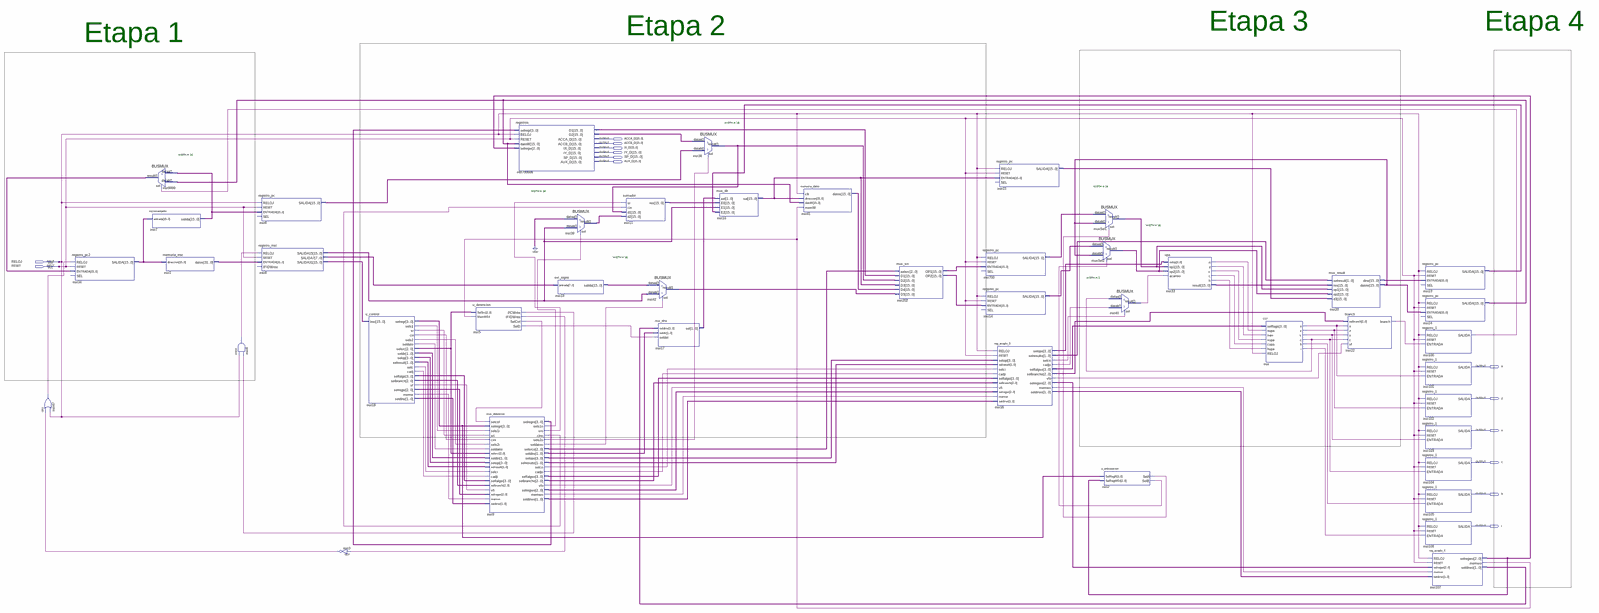
[diagram p0: schematic sheet, whole]
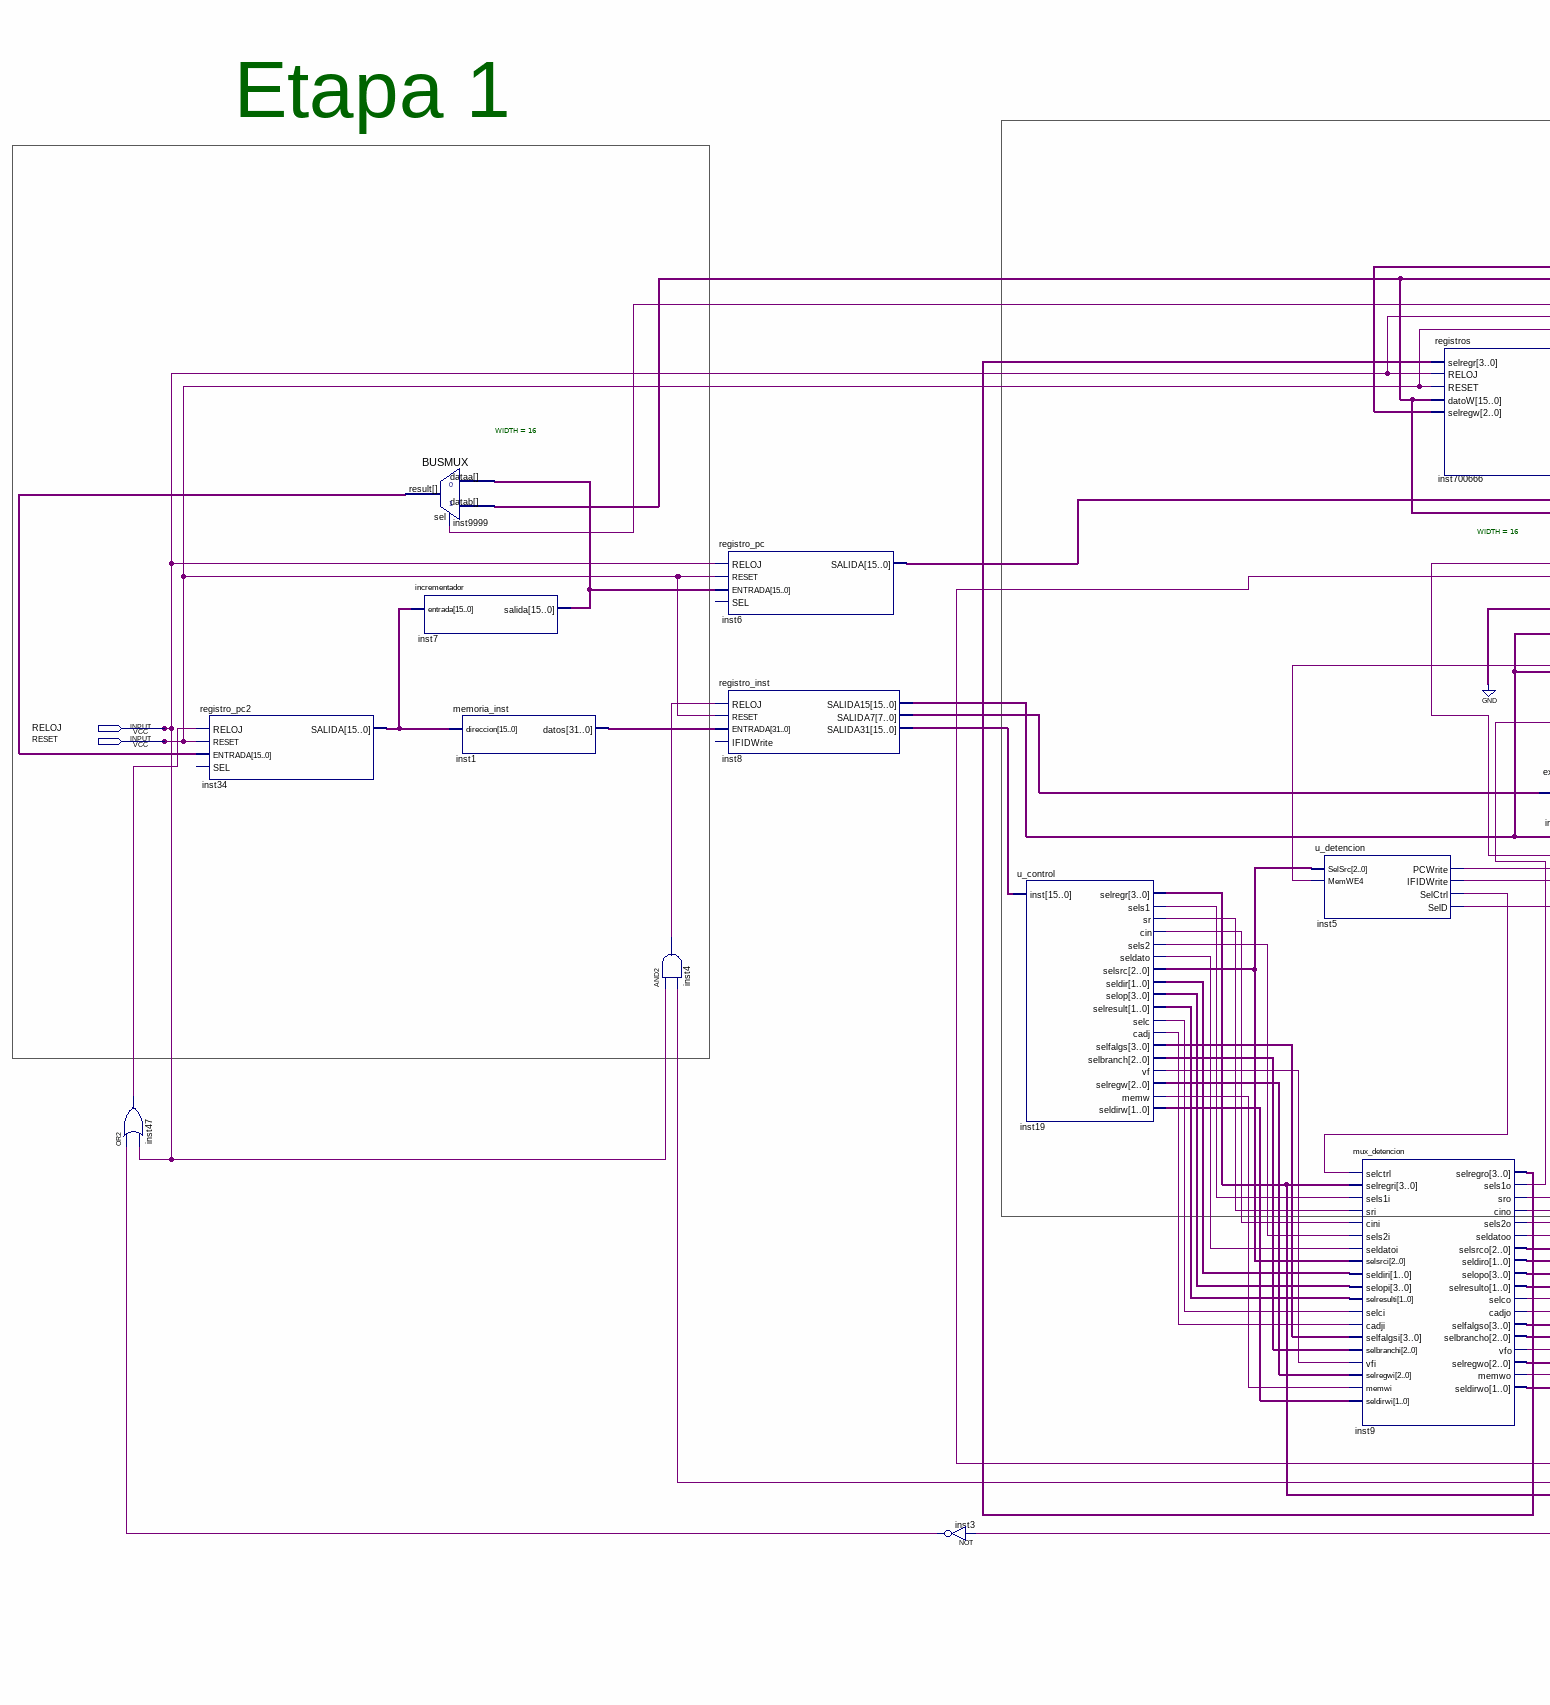
[diagram p1: schematic sheet, left part]
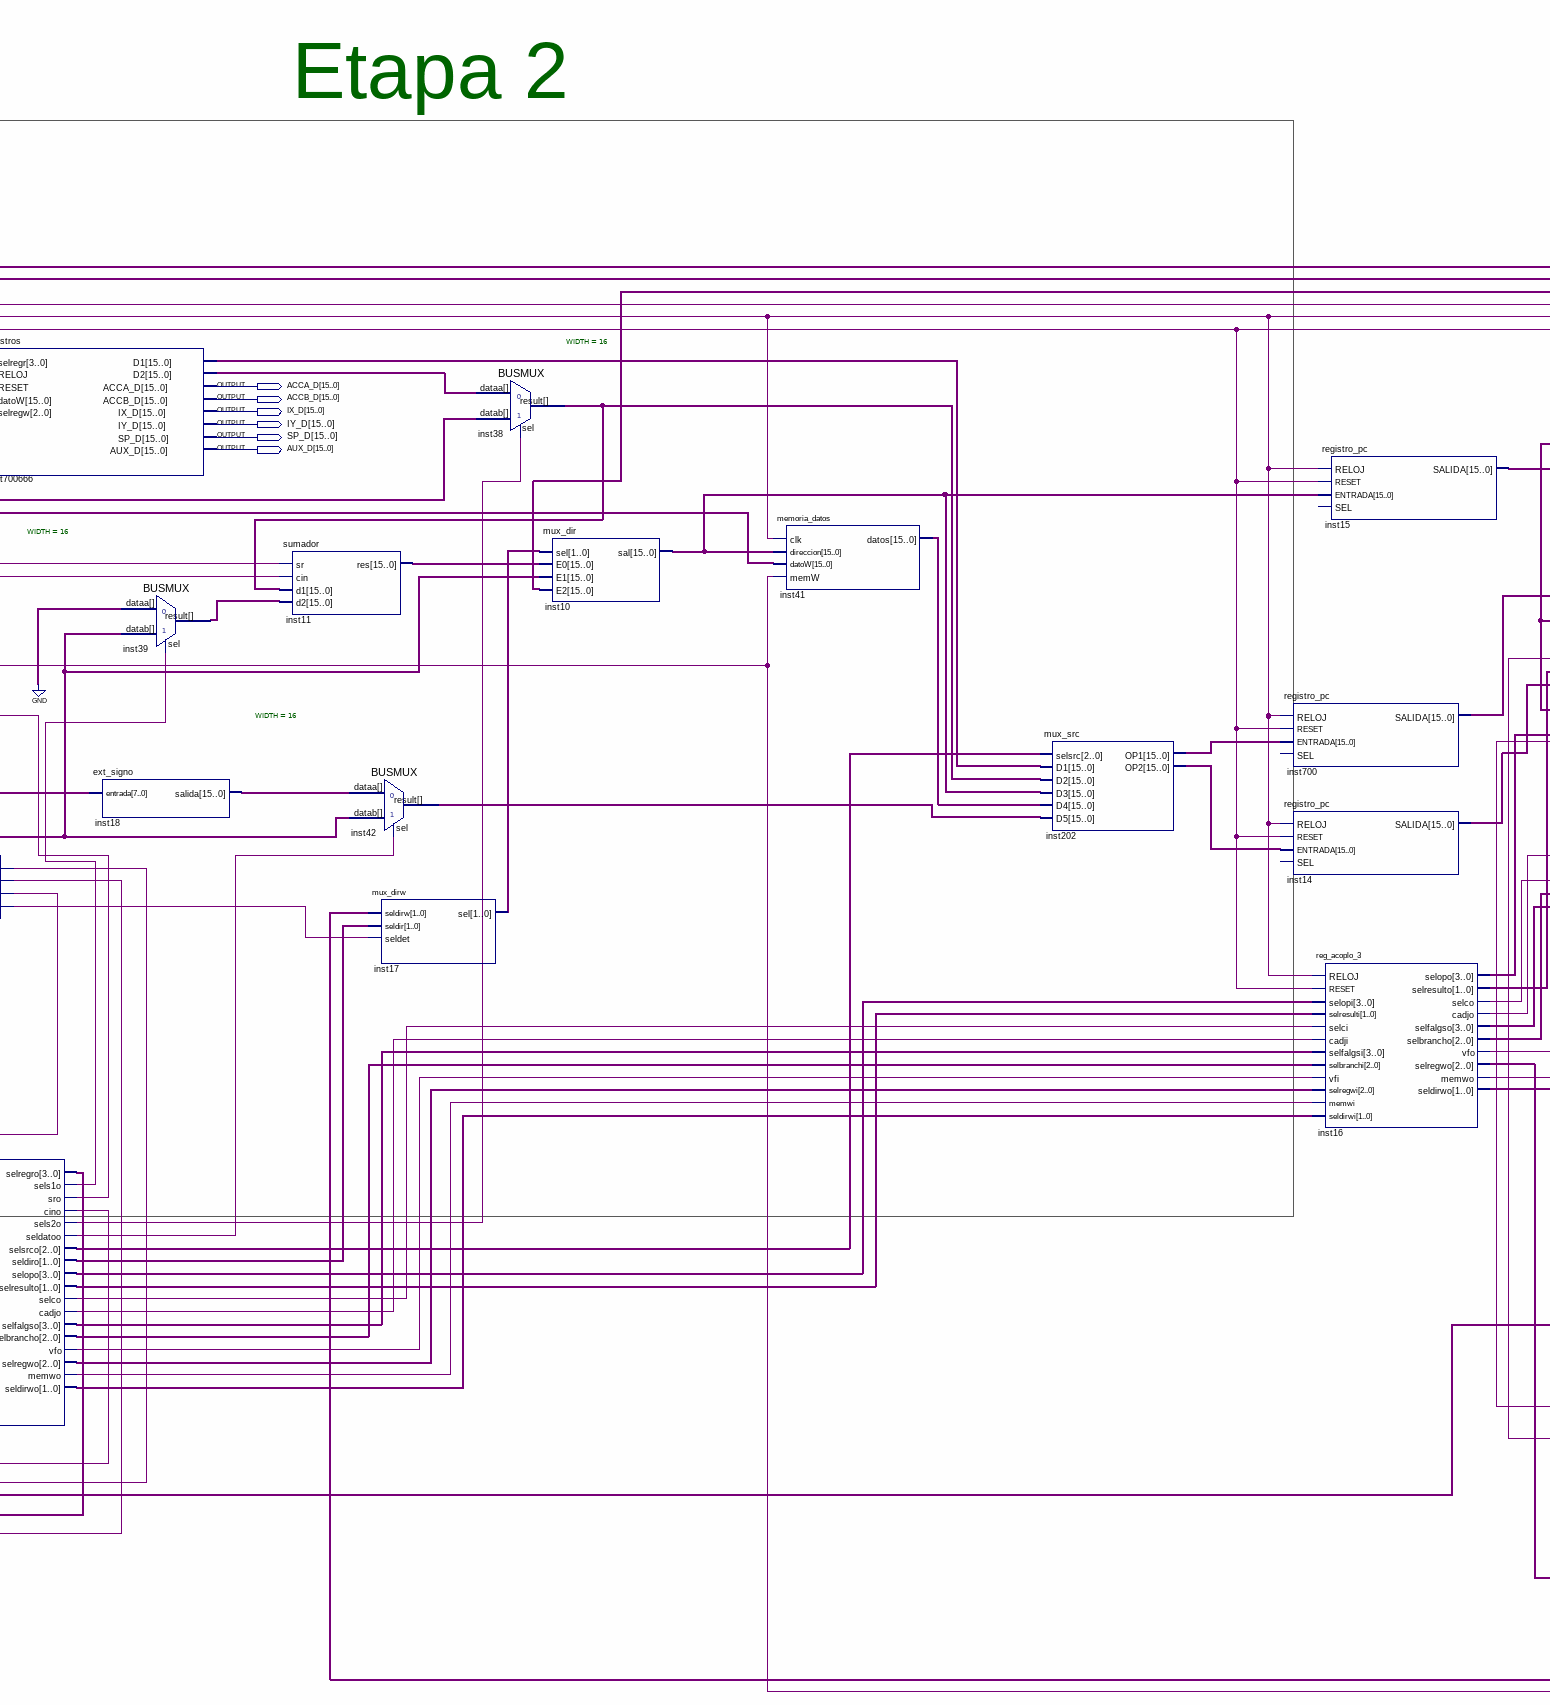
[diagram p2: schematic sheet, centre part]
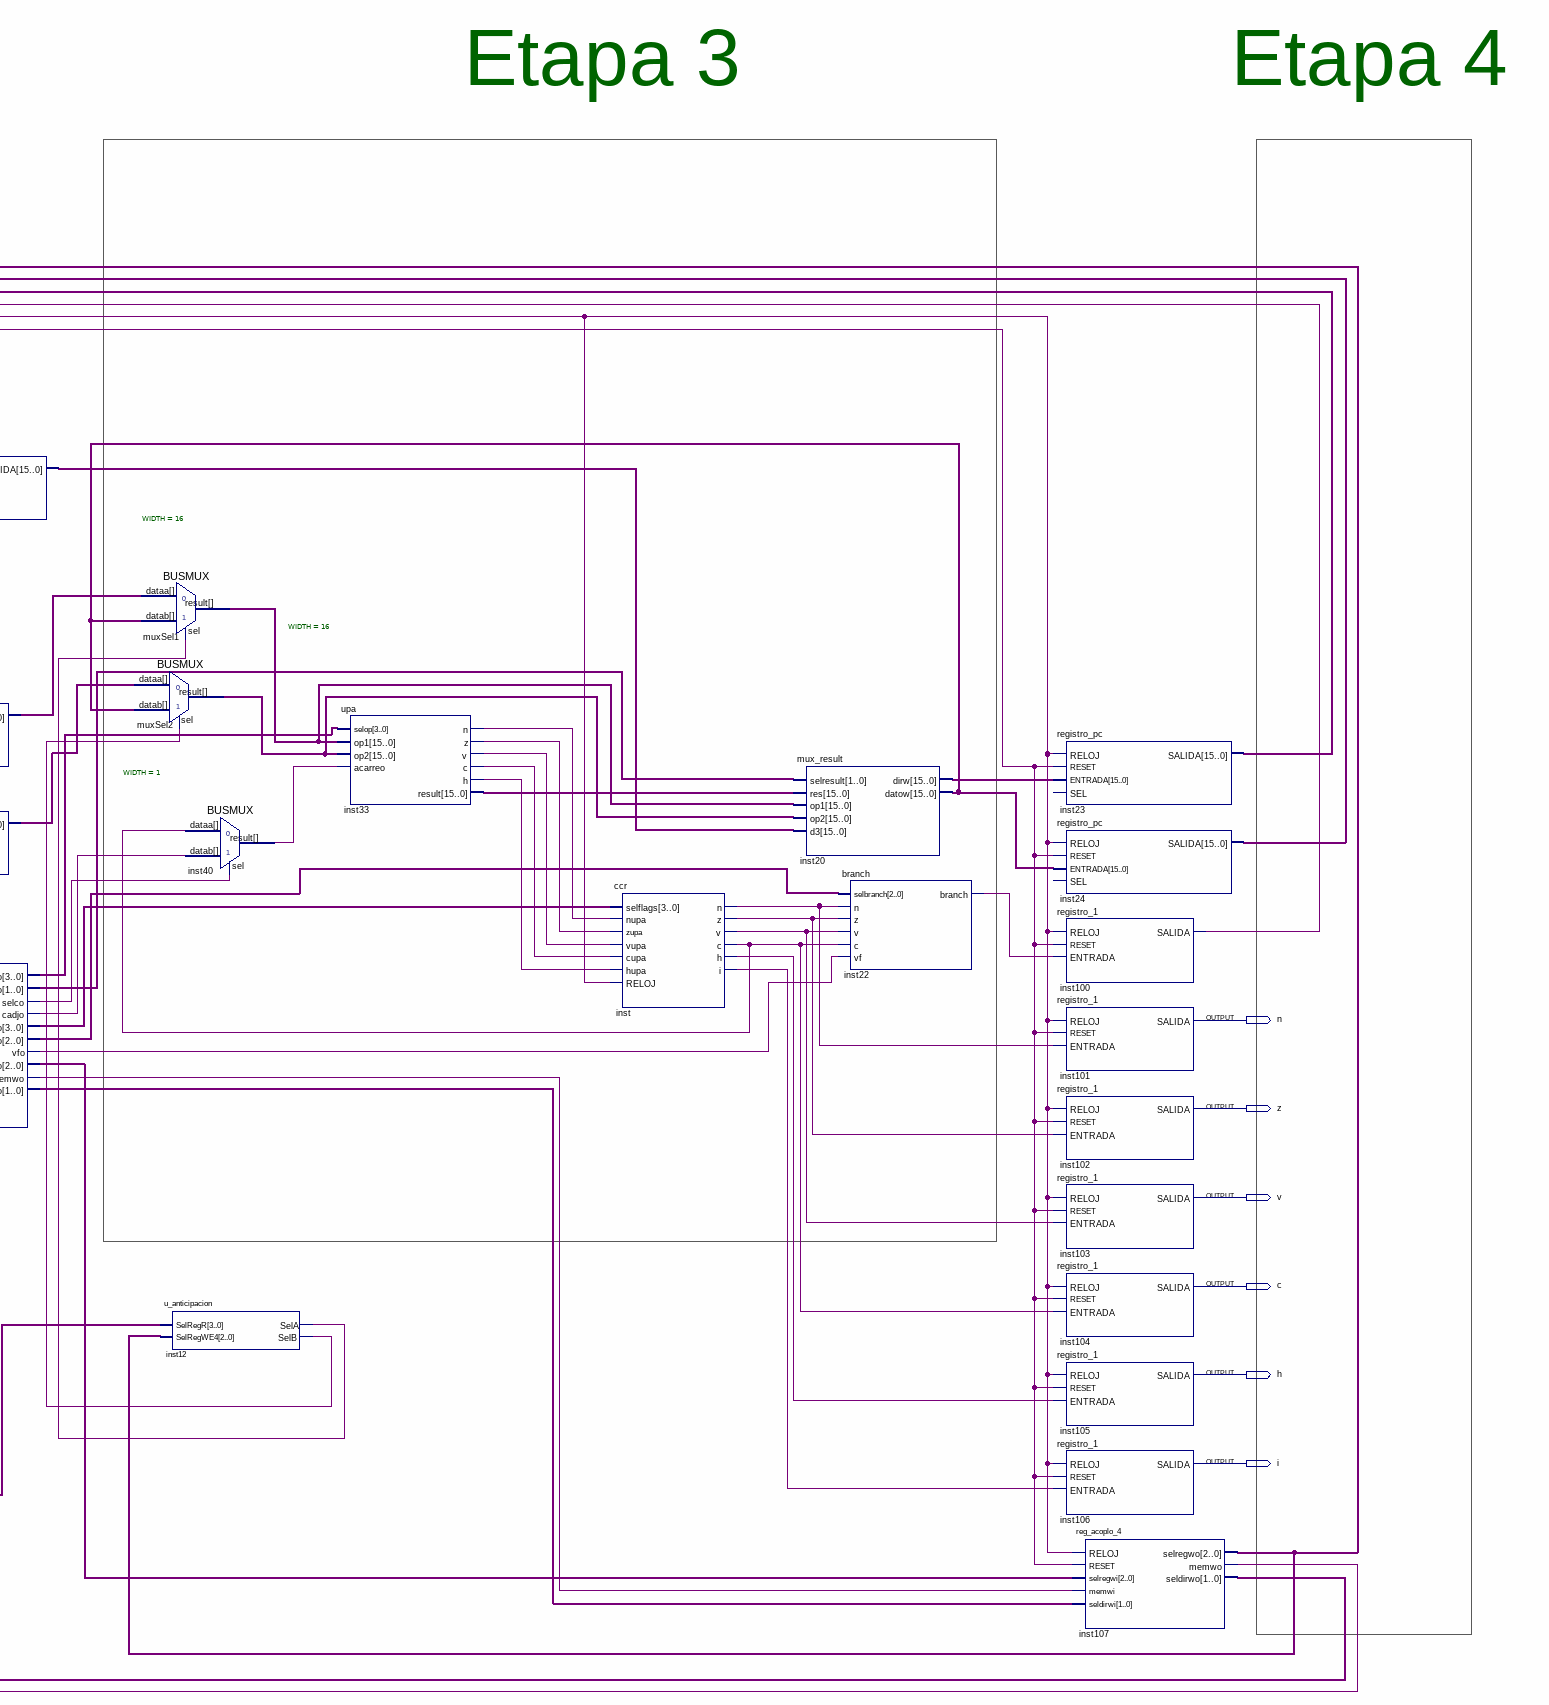
[diagram p3: schematic sheet, right part]
// Quartus schematic pipeline.bdf as structural Verilog: 44 symbols, 14 pins
module pipeline (
  input  RELOJ,
  input  RESET,
  output [15:0] ACCA_D,
  output [15:0] ACCB_D,
  output [15:0] IX_D,
  output [15:0] IY_D,
  output [15:0] SP_D,
  output [15:0] AUX_D,
  output n,
  output z,
  output v,
  output c,
  output h,
  output i
);

  wire inst3_out, inst4_out, inst5_ifidwrite, inst5_pcwrite, inst5_selctrl, inst5_seld, inst9_cadjo,
       inst9_cino, inst9_memwo, inst9_selco, inst9_seldatoo, inst9_sels1o, inst9_sels2o, inst9_sro,
       inst9_vfo, inst12_sela, inst12_selb, inst16_cadjo, inst16_memwo, inst16_selco, inst16_vfo,
       inst19_cadj, inst19_cin, inst19_memw, inst19_selc, inst19_seldato, inst19_sels1, inst19_sels2,
       inst19_sr, inst19_vf, inst22_branch, inst33_c, inst33_h, inst33_n, inst33_v, inst33_z, inst40_result,
       inst47_out, inst100_salida, inst107_memwo, inst_c, inst_h, inst_i, inst_n, inst_v, inst_z;
  wire [1:0] inst9_seldiro, inst9_seldirwo, inst9_selresulto, inst16_seldirwo, inst16_selresulto, inst17_sel,
       inst19_seldir, inst19_seldirw, inst19_selresult, inst107_seldirwo;
  wire [2:0] inst9_selbrancho, inst9_selregwo, inst9_selsrco, inst16_selbrancho, inst16_selregwo,
       inst19_selbranch, inst19_selregw, inst19_selsrc, inst107_selregwo;
  wire [3:0] inst9_selfalgso, inst9_selopo, inst9_selregro, inst16_selfalgso, inst16_selopo, inst19_selfalgs,
       inst19_selop, inst19_selregr;
  wire [7:0] inst8_salida7;
  wire [15:0] inst6_salida, inst7_salida, inst8_salida15, inst8_salida31, inst10_sal, inst11_res,
       inst14_salida, inst15_salida, inst18_salida, inst20_datow, inst20_dirw, inst23_salida, inst24_salida,
       inst33_result, inst34_salida, inst38_result, inst39_result, inst41_datos, inst42_result, inst202_op1,
       inst202_op2, inst700_salida, inst9999_result, inst700666_d1, inst700666_d2, muxSel1_result,
       muxSel2_result;
  wire [31:0] inst1_datos;

  or inst47 (inst47_out, inst3_out, RELOJ);
  registro_pc2 inst34 (
    .RELOJ(inst47_out), .RESET(RESET), .ENTRADA(inst9999_result), .SALIDA(inst34_salida));  // open: SEL
  BUSMUX #(.WIDTH(16)) inst9999 (
    .datab(inst24_salida), .sel(inst100_salida), .dataa(inst7_salida), .result(inst9999_result));
  incrementador inst7 (.entrada(inst34_salida), .salida(inst7_salida));
  memoria_inst inst1 (.direccion(inst34_salida), .datos(inst1_datos));
  and inst4 (inst4_out, RELOJ, inst5_pcwrite);
  registro_pc inst6 (.RELOJ(RELOJ), .RESET(RESET), .ENTRADA(inst7_salida), .SALIDA(inst6_salida));  // open: SEL
  registro_inst inst8 (
    .RELOJ(inst4_out), .RESET(RESET), .ENTRADA(inst1_datos), .SALIDA15(inst8_salida15),
    .SALIDA7(inst8_salida7), .SALIDA31(inst8_salida31));  // open: IFIDWrite
  not inst3 (inst3_out, inst5_ifidwrite);
  u_control inst19 (
    .inst(inst8_salida31), .selregr(inst19_selregr), .sels1(inst19_sels1), .sr(inst19_sr), .cin(inst19_cin),
    .sels2(inst19_sels2), .seldato(inst19_seldato), .selsrc(inst19_selsrc), .seldir(inst19_seldir),
    .selop(inst19_selop), .selresult(inst19_selresult), .selc(inst19_selc), .cadj(inst19_cadj),
    .selfalgs(inst19_selfalgs), .selbranch(inst19_selbranch), .vf(inst19_vf), .selregw(inst19_selregw),
    .memw(inst19_memw), .seldirw(inst19_seldirw));
  u_detencion inst5 (
    .SelSrc(inst19_selsrc), .MemWE4(inst107_memwo), .PCWrite(inst5_pcwrite), .IFIDWrite(inst5_ifidwrite),
    .SelCtrl(inst5_selctrl), .SelD(inst5_seld));
  mux_detencion inst9 (
    .selctrl(inst5_selctrl), .selregri(inst19_selregr), .sels1i(inst19_sels1), .sri(inst19_sr),
    .cini(inst19_cin), .sels2i(inst19_sels2), .seldatoi(inst19_seldato), .selsrci(inst19_selsrc),
    .seldiri(inst19_seldir), .selopi(inst19_selop), .selresulti(inst19_selresult), .selci(inst19_selc),
    .cadji(inst19_cadj), .selfalgsi(inst19_selfalgs), .selbranchi(inst19_selbranch), .vfi(inst19_vf),
    .selregwi(inst19_selregw), .memwi(inst19_memw), .seldirwi(inst19_seldirw), .selregro(inst9_selregro),
    .sels1o(inst9_sels1o), .sro(inst9_sro), .cino(inst9_cino), .sels2o(inst9_sels2o),
    .seldatoo(inst9_seldatoo), .selsrco(inst9_selsrco), .seldiro(inst9_seldiro), .selopo(inst9_selopo),
    .selresulto(inst9_selresulto), .selco(inst9_selco), .cadjo(inst9_cadjo), .selfalgso(inst9_selfalgso),
    .selbrancho(inst9_selbrancho), .vfo(inst9_vfo), .selregwo(inst9_selregwo), .memwo(inst9_memwo),
    .seldirwo(inst9_seldirwo));
  registros inst700666 (
    .selregr(inst9_selregro), .RELOJ(RELOJ), .RESET(RESET), .datoW(inst24_salida),
    .selregw(inst107_selregwo), .D1(inst700666_d1), .D2(inst700666_d2), .ACCA_D(ACCA_D), .ACCB_D(ACCB_D),
    .IX_D(IX_D), .IY_D(IY_D), .SP_D(SP_D), .AUX_D(AUX_D));
  ext_signo inst18 (.entrada(inst8_salida7), .salida(inst18_salida));
  BUSMUX #(.WIDTH(16)) inst39 (.datab(inst8_salida15), .sel(inst9_sels1o), .dataa({16{1'b0}}), .result(inst39_result));
  sumador inst11 (.sr(inst9_sro), .cin(inst9_cino), .d1(inst38_result), .d2(inst39_result), .res(inst11_res));
  BUSMUX #(.WIDTH(16)) inst42 (
    .datab(inst8_salida15), .sel(inst9_seldatoo), .dataa(inst18_salida), .result(inst42_result));
  mux_dirw inst17 (.seldirw(inst107_seldirwo), .seldir(inst9_seldiro), .seldet(inst5_seld), .sel(inst17_sel));
  BUSMUX #(.WIDTH(16)) inst38 (.datab(inst6_salida), .sel(inst9_sels2o), .dataa(inst700666_d2), .result(inst38_result));
  mux_dir inst10 (.sel(inst17_sel), .E0(inst11_res), .E1(inst8_salida15), .E2(inst23_salida), .sal(inst10_sal));
  memoria_datos inst41 (
    .clk(RELOJ), .direccion(inst10_sal), .datoW(inst24_salida), .memW(inst107_memwo), .datos(inst41_datos));
  mux_src inst202 (
    .selsrc(inst9_selsrco), .D1(inst700666_d1), .D2(inst38_result), .D3(inst10_sal), .D4(inst41_datos),
    .D5(inst42_result), .OP1(inst202_op1), .OP2(inst202_op2));
  registro_pc inst700 (.RELOJ(RELOJ), .RESET(RESET), .ENTRADA(inst202_op1), .SALIDA(inst700_salida));  // open: SEL
  registro_pc inst14 (.RELOJ(RELOJ), .RESET(RESET), .ENTRADA(inst202_op2), .SALIDA(inst14_salida));  // open: SEL
  registro_pc inst15 (.RELOJ(RELOJ), .RESET(RESET), .ENTRADA(inst10_sal), .SALIDA(inst15_salida));  // open: SEL
  reg_acoplo_3 inst16 (
    .RELOJ(RELOJ), .RESET(RESET), .selopi(inst9_selopo), .selresulti(inst9_selresulto), .selci(inst9_selco),
    .cadji(inst9_cadjo), .selfalgsi(inst9_selfalgso), .selbranchi(inst9_selbrancho), .vfi(inst9_vfo),
    .selregwi(inst9_selregwo), .memwi(inst9_memwo), .seldirwi(inst9_seldirwo), .selopo(inst16_selopo),
    .selresulto(inst16_selresulto), .selco(inst16_selco), .cadjo(inst16_cadjo), .selfalgso(inst16_selfalgso),
    .selbrancho(inst16_selbrancho), .vfo(inst16_vfo), .selregwo(inst16_selregwo), .memwo(inst16_memwo),
    .seldirwo(inst16_seldirwo));
  BUSMUX #(.WIDTH(16)) muxSel2 (
    .datab(inst20_datow), .sel(inst12_selb), .dataa(inst14_salida), .result(muxSel2_result));
  BUSMUX #(.WIDTH(16)) muxSel1 (
    .datab(inst20_datow), .sel(inst12_sela), .dataa(inst700_salida), .result(muxSel1_result));
  BUSMUX #(.WIDTH(1)) inst40 (.datab(inst16_cadjo), .sel(inst16_selco), .dataa(inst_c), .result(inst40_result));
  u_anticipacion inst12 (
    .SelRegR(inst19_selregr), .SelRegWE4(inst107_selregwo), .SelA(inst12_sela), .SelB(inst12_selb));
  upa inst33 (
    .selop(inst16_selopo), .op1(muxSel1_result), .op2(muxSel2_result), .acarreo(inst40_result), .n(inst33_n),
    .z(inst33_z), .v(inst33_v), .c(inst33_c), .h(inst33_h), .result(inst33_result));
  ccr inst (
    .selflags(inst16_selfalgso), .nupa(inst33_n), .zupa(inst33_z), .vupa(inst33_v), .cupa(inst33_c),
    .hupa(inst33_h), .RELOJ(RELOJ), .n(inst_n), .z(inst_z), .v(inst_v), .c(inst_c), .h(inst_h), .i(inst_i));
  mux_result inst20 (
    .selresult(inst16_selresulto), .res(inst33_result), .op1(muxSel1_result), .op2(muxSel2_result),
    .d3(inst15_salida), .dirw(inst20_dirw), .datow(inst20_datow));
  branch inst22 (
    .selbranch(inst16_selbrancho), .n(inst_n), .z(inst_z), .v(inst_v), .c(inst_c), .vf(inst16_vfo),
    .branch(inst22_branch));
  registro_pc inst23 (.RELOJ(RELOJ), .RESET(RESET), .ENTRADA(inst20_dirw), .SALIDA(inst23_salida));  // open: SEL
  registro_pc inst24 (.RELOJ(RELOJ), .RESET(RESET), .ENTRADA(inst20_datow), .SALIDA(inst24_salida));  // open: SEL
  registro_1 inst100 (.RELOJ(RELOJ), .RESET(RESET), .ENTRADA(inst22_branch), .SALIDA(inst100_salida));
  registro_1 inst101 (.RELOJ(RELOJ), .RESET(RESET), .ENTRADA(inst_n), .SALIDA(n));
  registro_1 inst102 (.RELOJ(RELOJ), .RESET(RESET), .ENTRADA(inst_z), .SALIDA(z));
  registro_1 inst103 (.RELOJ(RELOJ), .RESET(RESET), .ENTRADA(inst_v), .SALIDA(v));
  registro_1 inst104 (.RELOJ(RELOJ), .RESET(RESET), .ENTRADA(inst_c), .SALIDA(c));
  registro_1 inst105 (.RELOJ(RELOJ), .RESET(RESET), .ENTRADA(inst_h), .SALIDA(h));
  registro_1 inst106 (.RELOJ(RELOJ), .RESET(RESET), .ENTRADA(inst_i), .SALIDA(i));
  reg_acoplo_4 inst107 (
    .RELOJ(RELOJ), .RESET(RESET), .selregwi(inst16_selregwo), .memwi(inst16_memwo),
    .seldirwi(inst16_seldirwo), .selregwo(inst107_selregwo), .memwo(inst107_memwo),
    .seldirwo(inst107_seldirwo));

  // Notes on the sheet:
  //   Etapa 3
  //   Etapa 4
  //   Etapa 2
  //   Etapa 1
endmodule
